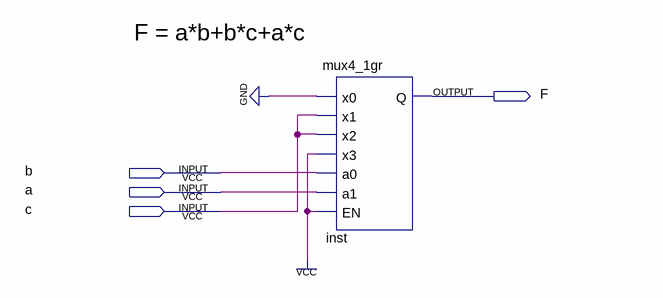
[diagram p0: schematic sheet]
// Quartus schematic log2.bdf as structural Verilog: 1 symbols, 4 pins
module log2 (
  input  b,
  input  a,
  input  c,
  output F
);

  mux4_1gr inst (.x0(1'b0), .x1(c), .x2(c), .x3(1'b1), .a0(b), .a1(a), .EN(1'b1), .Q(F));

  // Notes on the sheet:
  //   F = a*b+b*c+a*c
endmodule
